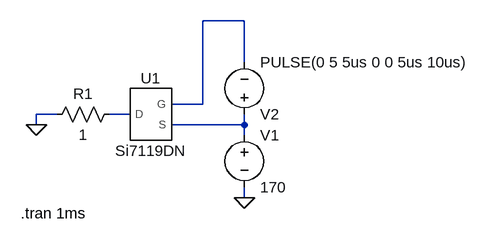
[diagram p0: schematic SI7119DN test 2.asc]
SI7119DN test 2.asc, the LTspice schematic file:
Version 4
SHEET 1 880 680
WIRE 288 0 224 0
WIRE 288 64 288 0
WIRE 224 128 224 0
WIRE 224 128 176 128
WIRE 0 144 -32 144
WIRE 112 144 80 144
WIRE -32 160 -32 144
WIRE 288 160 288 144
WIRE 288 160 176 160
WIRE 288 176 288 160
WIRE 288 272 288 256
FLAG 288 272 0
FLAG -32 160 0
SYMBOL AutoGenerated\\Si7119DN 144 144 R0
SYMATTR InstName U1
SYMBOL voltage 288 160 R0
WINDOW 123 0 0 Left 0
WINDOW 39 0 0 Left 0
SYMATTR InstName V1
SYMATTR Value 170
SYMBOL voltage 288 160 M180
WINDOW 123 0 0 Left 0
WINDOW 39 0 0 Left 0
SYMATTR InstName V2
SYMATTR Value PULSE(0 5 5us 0 0 5us 10us)
SYMBOL res 96 128 R90
WINDOW 0 0 56 VBottom 2
WINDOW 3 32 56 VTop 2
SYMATTR InstName R1
SYMATTR Value 1
TEXT -56 296 Left 2 !.tran 1ms

The netlist it stands for:
* SI7119DN test 2.asc
XU1 N002 N001 N003 Si7119DN  ; pins D G S
V1 N003 0 170
V2 N003 N001 PULSE(0 5 5us 0 0 5us 10us)
R1 N002 0 1
.tran 1ms
.lib Z:\media\Daten\Projekte\ELController\ltspice model\si7119dn\si7119dn_ps.lib
.backanno
.end